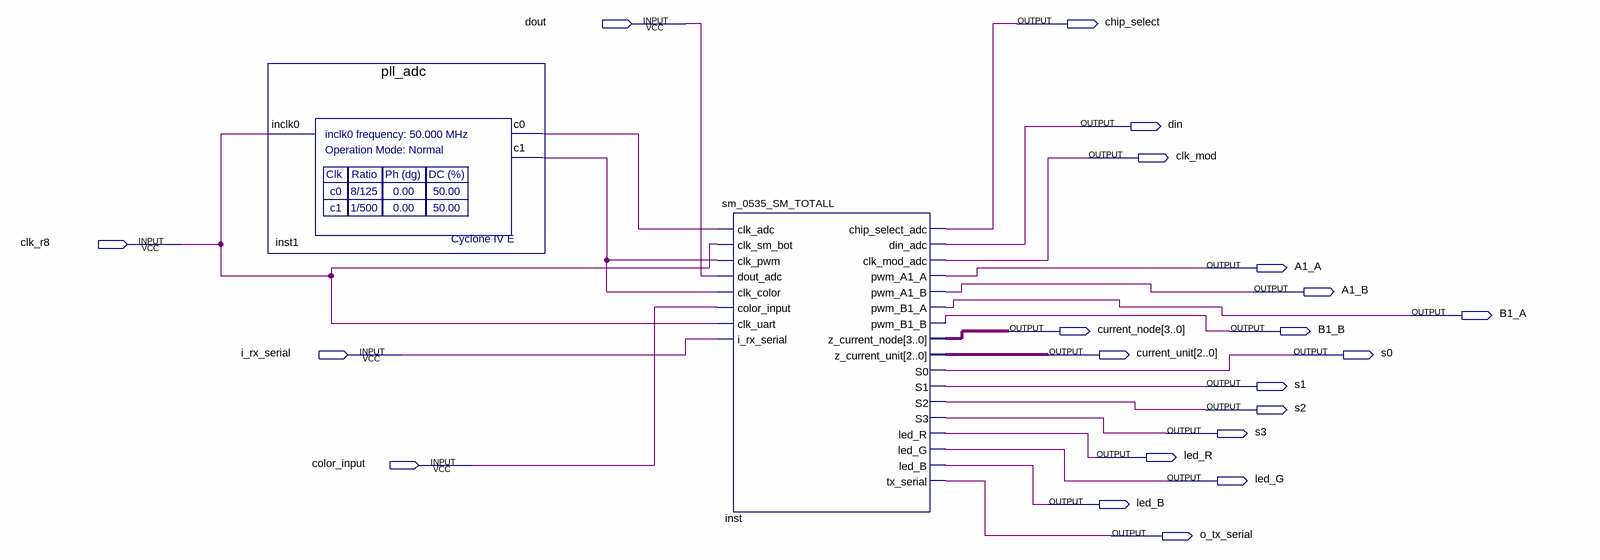
[diagram p0: schematic sheet]
// Quartus schematic sm_tot_block.bdf as structural Verilog: 2 symbols, 21 pins
module sm_tot_block (
  input  dout,
  input  clk_r8,
  input  i_rx_serial,
  input  color_input,
  output chip_select,
  output din,
  output clk_mod,
  output A1_A,
  output A1_B,
  output B1_A,
  output [3:0] current_node,
  output B1_B,
  output [2:0] current_unit,
  output s0,
  output s1,
  output s2,
  output s3,
  output led_R,
  output led_G,
  output led_B,
  output o_tx_serial
);

  wire inst1_c0, inst1_c1;

  pll_adc inst1 (.inclk0(clk_r8), .c0(inst1_c0), .c1(inst1_c1));
  sm_0535_SM_TOTALL inst (
    .clk_adc(inst1_c0), .clk_sm_bot(clk_r8), .clk_pwm(inst1_c1), .dout_adc(dout), .clk_color(inst1_c1),
    .color_input(color_input), .clk_uart(clk_r8), .i_rx_serial(i_rx_serial), .chip_select_adc(chip_select),
    .din_adc(din), .clk_mod_adc(clk_mod), .pwm_A1_A(A1_A), .pwm_A1_B(A1_B), .pwm_B1_A(B1_A), .pwm_B1_B(B1_B),
    .z_current_node(current_node), .z_current_unit(current_unit), .S0(s0), .S1(s1), .S2(s2), .S3(s3),
    .led_R(led_R), .led_G(led_G), .led_B(led_B), .tx_serial(o_tx_serial));
endmodule
